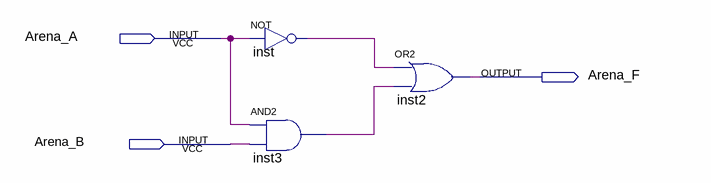
[diagram p0: schematic sheet]
// Quartus schematic Arena_simpleCircuit.bdf as structural Verilog: 3 symbols, 3 pins
module Arena_simpleCircuit (
  input  Arena_A,
  input  Arena_B,
  output Arena_F
);

  wire inst3_out, inst_out;

  not inst (inst_out, Arena_A);
  and inst3 (inst3_out, Arena_A, Arena_B);
  or inst2 (Arena_F, inst_out, inst3_out);
endmodule
